# EAGLE design usbdimmer-control-vertical (EAGLE 6.5.0)
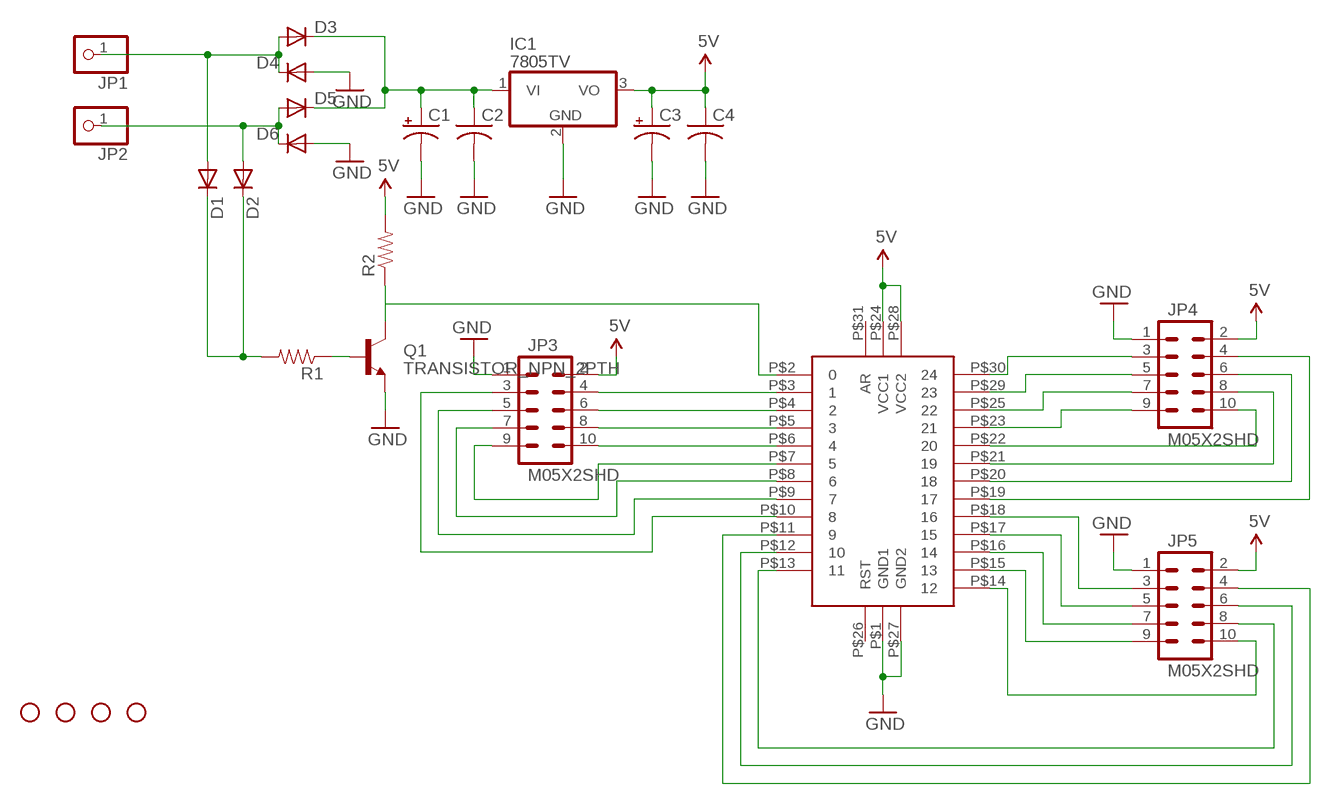
[diagram p0: schematic, sheet 1]

## Parts
C1  CPOL-USE3.5-10  [E3,5-10]
C2  C-US025-030X050  [C025-030X050]
C3  CPOL-USE3.5-10  [E3,5-10]
C4  C-US025-030X050  [C025-030X050]
D1  DIODE1N4148  [DIODE-1N4148]
D2  DIODE1N4148  [DIODE-1N4148]
D3  DIODEPTH  [DIODE-1N4001]
D4  DIODEPTH  [DIODE-1N4001]
D5  DIODEPTH  [DIODE-1N4001]
D6  DIODEPTH  [DIODE-1N4001]
IC1  7805TV  [TO220V]
IC2  TEENSY2  [TEENSY2]
JP1  PINHD-1X1  [1X01]
JP2  PINHD-1X1  [1X01]
JP3  M05X2SHD  [2X5-SHROUDED]
JP4  M05X2SHD  [2X5-SHROUDED]
JP5  M05X2SHD  [2X5-SHROUDED]
Q1  TRANSISTOR_NPN_2PTH  [TO-92]
R1  RESISTORPTH-1/4W  [AXIAL-0.4]
R2  RESISTORPTH-1/4W  [AXIAL-0.4]
STANDOFF1  STAND-OFF  [STAND-OFF]
STANDOFF2  STAND-OFF  [STAND-OFF]
STANDOFF3  STAND-OFF  [STAND-OFF]
STANDOFF4  STAND-OFF  [STAND-OFF]

## Nets
5V: C3.+ C4.1 IC1.3(VO) IC2.P$24(VCC1) IC2.P$28(VCC2) JP3.2 JP4.2 JP5.2 R2.P$2
GND: C1.- C2.2 C3.- C4.2 D4.A D6.A IC1.2(GND) IC2.P$1(GND1) IC2.P$27(GND2) JP3.1 JP4.1 JP5.1 Q1.3(E)
N$1: D2.A D5.A D6.C JP2.1
N$2: D1.A D3.A D4.C JP1.1
N$3: C1.+ C2.1 D3.C D5.C IC1.1(VI)
N$4: IC2.P$21 JP4.8
N$5: IC2.P$20 JP4.6
N$6: Q1.2(B) R1.P$1
N$7: D1.C D2.C R1.P$2
N$8: IC2.P$2 Q1.1(C) R2.P$1
N$9: IC2.P$19 JP4.4
N$10: IC2.P$18 JP5.3
N$12: IC2.P$3 JP3.4
N$13: IC2.P$4 JP3.6
N$14: IC2.P$5 JP3.8
N$15: IC2.P$6 JP3.10
N$16: IC2.P$7 JP3.9
N$17: IC2.P$8 JP3.7
N$19: IC2.P$17 JP5.5
N$20: IC2.P$16 JP5.7
N$21: IC2.P$9 JP3.5
N$22: IC2.P$10 JP3.3
N$23: IC2.P$30 JP4.3
N$24: IC2.P$15 JP5.9
N$25: IC2.P$14 JP5.10
N$26: IC2.P$29 JP4.5
N$27: IC2.P$25 JP4.7
N$28: IC2.P$23 JP4.9
N$29: IC2.P$22 JP4.10
N$30: IC2.P$13 JP5.8
N$31: IC2.P$12 JP5.6
N$32: IC2.P$11 JP5.4
Unconnected: IC2.P$26(RST) IC2.P$31(AR)

## Library data of the parts
C1 C3 = adafruit:CPOL-US: POLARIZED CAPACITOR, American symbol
C2 C4 = adafruit:C-US: CAPACITOR, American symbol
D1-D6 = SparkFun-DiscreteSemi:DIODE: Diode These are standard reverse protection diodes and small signal diodes. SMA package can handle up to about 1A. SOD-323 can handle about 200mA. What the SOD-323 package when ordering, there are some mfgs out there that are 5-pin packages.
IC1 = linear:78*: Positive VOLTAGE REGULATOR Source: http://cache.national.com/ds/LM/LM78L05.pdf http://www.fairchildsemi.com/ds/LM/LM7805.pdf
IC2 = bodger:TEENSY2
JP1 JP2 = adafruit:PINHD-1X1: Pin header 1x1 for 0.1" spacing With round pins
JP3-JP5 = SparkFun-Connectors:M05X2: Header 5x2 Standard 10-pin dual row 0.1" header. Commonly used with AVR-ISP. Use with Spark Fun Electronics SKU: PRT-00778
Q1 = SparkFun-DiscreteSemi:TRANSISTOR_NPN_2: Alternate TO-92 NPN BJT
R1 R2 = SparkFun-Passives:RESISTOR: Resistor Basic schematic elements and footprints for 0603, 1206, and PTH resistors.
STANDOFF1-STANDOFF4 = SparkFun-Electromechanical:STAND-OFF: #4 Stand Off This is the mechanical footprint for a #4 phillips button head screw. Use the keepout ring to avoid running the screw head into surrounding components. SKU : PRT-00447

## Board
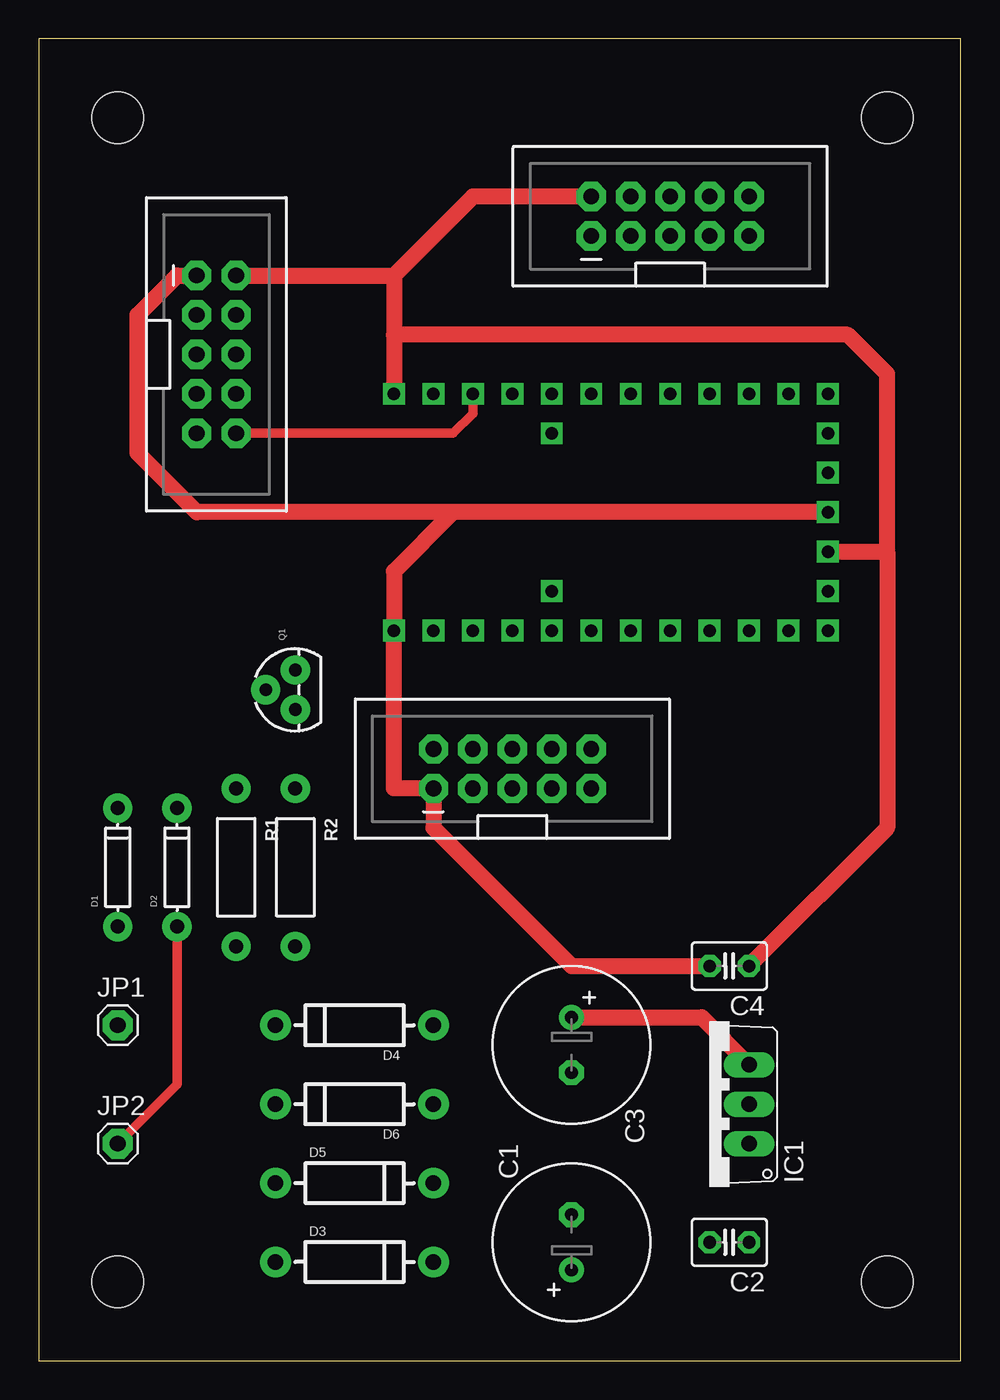
[diagram p1: board, top side]
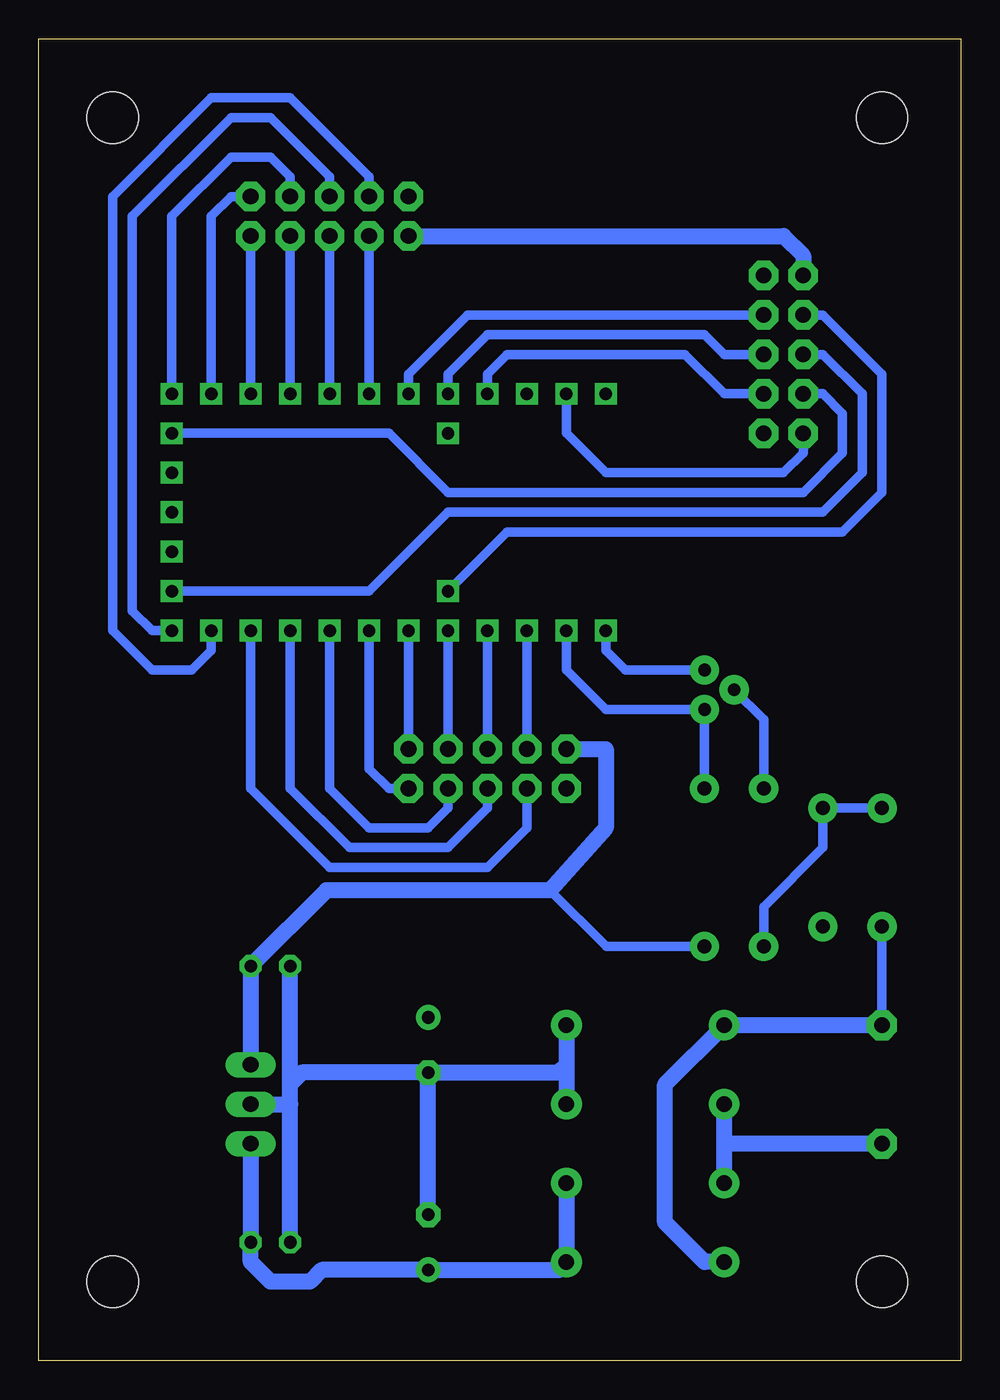
[diagram p2: board, bottom side, seen from below]

Size 59.36 x 85.08 mm. Coordinates in mm from the lower left corner, seen from the top.
Outline: 0,0 59.36,0 59.36,85.08 0,85.08 0,0
Copper layers (1*16): Top 0.035mm / dielectric 1.5mm / Bottom 0.035mm
Design rules "SparkFun": minimum track width 8mil, minimum drill 20mil, track to track 8mil, track to pad 8mil, pad to pad 8mil, via to via 8mil, smd to smd 8mil, copper to edge 10mil, drill to drill 8mil, minimum pad ring 12mil, minimum via ring 10mil, stop-mask expansion 4mil, vias tented up to drill 25mil, thermal gap 10mil

### Footprints (pad centres in the part's own frame; a part is rotated, then mirrored left to right if it is on the bottom)
E3,5-10 = drill 0.813 pad 1.6: + -1.778,0 | drill 0.813 pad 1.6 octagon: - 1.778,0
C025-030X050 = drill 0.813 pad 1.422 octagon: 1 -1.27,0; 2 1.27,0
DIODE-1N4148 = drill 0.9 pad 1.88: A -3.81,0; C 3.81,0
DIODE-1N4001 = drill 1 pad 1.981: A -5.08,0; C 5.08,0
TO220V = drill 1.016 long: 1 -2.54,-2.54; 2 0,-2.54; 3 2.54,-2.54
TEENSY2 = drill 0.8 square: P$1 -7.62,15.24; P$2 -7.62,12.7; P$3 -7.62,10.16; P$4 -7.62,7.62; P$5 -7.62,5.08; P$6 -7.62,2.54; P$7 -7.62,0; P$8 -7.62,-2.54; P$9 -7.62,-5.08; P$10 -7.62,-7.62; P$11 -7.62,-10.16; P$12 -7.62,-12.7; P$13 7.62,-12.7; P$14 7.62,-10.16; P$15 7.62,-7.62; P$16 7.62,-5.08; P$17 7.62,-2.54; P$18 7.62,0; P$19 7.62,2.54; P$20 7.62,5.08; P$21 7.62,7.62; P$22 7.62,10.16; P$23 7.62,12.7; P$24 7.62,15.24; P$25 5.08,-12.7; P$26 2.54,-12.7; P$27 0,-12.7; P$28 -2.54,-12.7; P$29 -5.08,-12.7; P$30 -5.08,5.08; P$31 5.08,5.08
1X01 = drill 1.016 pad 1.93 octagon: 1 0,0
2X5-SHROUDED = drill 1.016 pad 1.88 octagon: 1 -1.27,5.08; 2 1.27,5.08; 3 -1.27,2.54; 4 1.27,2.54; 5 -1.27,0; 6 1.27,0; 7 -1.27,-2.54; 8 1.27,-2.54; 9 -1.27,-5.08; 10 1.27,-5.08
TO-92 = drill 0.813 pad 1.88: 1 -1.27,0; 2 0,1.905; 3 1.27,0
AXIAL-0.4 = drill 0.9 pad 1.88: P$1 -5.08,0; P$2 5.08,0
STAND-OFF = hole 3.302: 0,0

### Placement (x,y rotation side)
C1  34.29,7.62 90 top
C2  44.45,7.62 180 top
C3  34.29,20.32 270 top
C4  44.45,25.4 180 top
D1  5.08,31.75 90 top
D2  8.89,31.75 90 top
D3  20.32,6.35 0 top
D4  20.32,21.59 180 top
D5  20.32,11.43 0 top
D6  20.32,16.51 180 top
IC1  43.18,16.51 90 top
IC2  38.1,54.61 90 top
JP1  5.08,21.59 0 top
JP2  5.08,13.97 0 top
JP3  30.48,38.1 90 top
JP4  11.43,64.77 0 top
JP5  40.64,73.66 90 top
Q1  16.51,43.18 90 top
R1  12.7,31.75 270 top
R2  16.51,31.75 270 top
STANDOFF1  5.08,80.01 0 top
STANDOFF2  5.08,5.08 0 top
STANDOFF3  54.61,80.01 0 top
STANDOFF4  54.61,5.08 352.2 top

### Tracks (layer width: path | path; a pad name or v marks a point on that pad's centre or on a via)
5V
  Top 1.016: C3.+ 42.67,22.1 IC1.3 | JP5.2 27.94,74.93 22.86,69.85 | 22.86,69.85 22.86,66.04 | 22.86,66.04 IC2.P$24 | JP4.2 22.86,69.85 | 54.61,52.07 54.61,63.5 52.07,66.04 22.86,66.04 | IC2.P$28 54.61,52.07 | 54.61,52.07 54.61,34.29 C4.1
  Bottom 0.61: R2.P$2 22.84,26.67 26.44,30.28
  Bottom 1.016: IC1.3 C4.1 40.84,30.28 26.44,30.28 22.86,34.29 22.86,39.37 JP3.2
GND
  Top 1.016: IC2.P$27 26.67,54.61 | 26.67,54.61 22.86,50.8 IC2.P$1 22.86,36.83 JP3.1 25.4,34.29 34.29,25.4 C4.2 | 26.67,54.61 10.16,54.61 6.35,58.42 6.35,67.31 8.89,69.85 JP4.1
  Bottom 0.61: Q1.3 21.59,44.45 22.86,45.72 IC2.P$1
  Bottom 1.016: D4.A 25.4,19.05 | 25.4,19.05 D6.A | C2.2 43.18,16.51 | 43.18,16.51 43.18,17.78 | 43.18,17.78 C4.2 | IC1.2 43.18,16.51 | C3.- 25.91,18.54 25.4,19.05 | JP5.1 11.43,72.39 10.16,71.12 JP4.1 | C1.- C3.- | C3.- 42.42,18.54 43.18,17.78
N$1
  Top 0.61: D2.A 8.89,17.78 JP2.1
  Bottom 1.016: D5.A 15.24,13.97 | 15.24,13.97 D6.C | JP2.1 15.24,13.97
N$2
  Bottom 0.61: D1.A JP1.1
  Bottom 1.016: D3.A 16.51,6.35 19.05,8.89 19.05,17.78 D4.C JP1.1
N$3
  Bottom 1.016: D5.C D3.C 25.91,5.84 C1.+ 41.15,5.84 41.91,5.08 44.45,5.08 45.72,6.35 C2.1 IC1.1
N$4
  Bottom 0.61: JP4.8 15.24,62.23 17.78,64.77 29.21,64.77 30.48,63.5 IC2.P$21
N$5
  Bottom 0.61: JP4.6 15.24,64.77 16.51,66.04 30.48,66.04 33.02,63.5 IC2.P$20
N$6
  Bottom 0.61: 13.97,42.55 Q1.2 12.7,41.27 R1.P$1
N$7
  Bottom 0.61: D1.C D2.C | 8.89,34.29 D2.C | R1.P$2 12.7,29.21 8.89,33.02 D2.C
N$8
  Bottom 0.61: IC2.P$2 25.4,44.45 22.86,41.91 Q1.1 R2.P$1
N$9
  Bottom 0.61: JP4.4 31.75,67.31 35.56,63.5 IC2.P$19
N$10
  Bottom 0.61: IC2.P$18 JP5.3
N$12
  Bottom 0.61: JP3.4 IC2.P$3
N$13
  Bottom 0.61: JP3.6 IC2.P$4
N$14
  Bottom 0.61: JP3.8 IC2.P$5
N$15
  Bottom 0.61: JP3.10 IC2.P$6
N$16
  Bottom 0.61: JP3.9 36.83,36.83 38.1,38.1 IC2.P$7
N$17
  Bottom 0.61: IC2.P$8 40.64,36.83 38.1,34.29 34.29,34.29 33.02,35.56 JP3.7
N$19
  Bottom 0.61: IC2.P$17 JP5.5
N$20
  Bottom 0.61: IC2.P$16 JP5.7
N$21
  Bottom 0.61: IC2.P$9 43.18,36.83 39.37,33.02 33.02,33.02 30.48,35.56 JP3.5
N$22
  Bottom 0.61: IC2.P$10 45.72,36.83 40.64,31.75 30.48,31.75 27.94,34.29 JP3.3
N$23
  Bottom 0.61: IC2.P$30 29.21,53.34 7.62,53.34 5.08,55.88 5.08,63.5 8.89,67.31 JP4.3
N$24
  Bottom 0.61: IC2.P$15 JP5.9
N$25
  Bottom 0.61: IC2.P$14 48.26,73.66 46.99,74.93 JP5.10
N$26
  Bottom 0.61: JP4.5 8.89,64.77 6.35,62.23 6.35,57.15 8.89,54.61 33.02,54.61 38.1,49.53 IC2.P$29
N$27
  Bottom 0.61: JP4.7 8.89,62.23 7.62,60.96 7.62,58.42 10.16,55.88 33.02,55.88 36.83,59.69 IC2.P$25
N$28
  Bottom 0.61: JP4.9 10.16,58.42 11.43,57.15 22.86,57.15 25.4,59.69 IC2.P$23
N$29
  Top 0.61: JP4.10 26.67,59.69 27.94,60.96 IC2.P$22
N$30
  Bottom 0.61: IC2.P$13 50.8,73.66 46.99,77.47 44.45,77.47 43.18,76.2 JP5.8
N$31
  Bottom 0.61: IC2.P$12 52.07,46.99 53.34,48.26 53.34,73.66 46.99,80.01 44.45,80.01 40.64,76.2 JP5.6
N$32
  Bottom 0.61: IC2.P$11 48.26,45.72 49.53,44.45 52.07,44.45 54.61,46.99 54.61,74.93 48.26,81.28 43.18,81.28 38.1,76.2 JP5.4